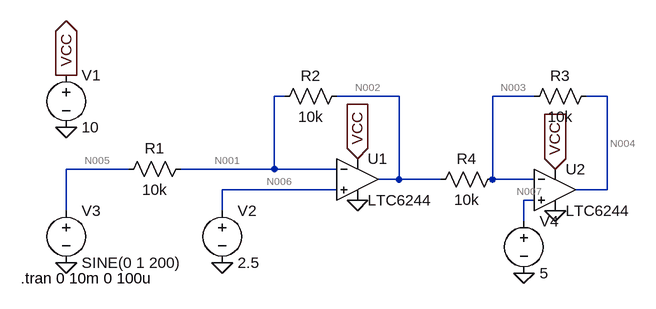
[diagram p0: schematic Draft1.asc]
Draft1.asc, the LTspice schematic file:
Version 4
SHEET 1 880 680
WIRE 256 48 240 48
WIRE 432 48 336 48
WIRE 640 48 576 48
WIRE 752 48 720 48
WIRE 16 160 -80 160
WIRE 240 160 240 48
WIRE 240 160 96 160
WIRE 336 160 240 160
WIRE 432 176 432 48
WIRE 432 176 400 176
WIRE 496 176 432 176
WIRE 576 176 576 48
WIRE 640 176 576 176
WIRE 336 192 160 192
WIRE 752 192 752 48
WIRE 752 192 704 192
WIRE 640 208 624 208
WIRE -80 224 -80 160
WIRE 160 224 160 192
WIRE 624 240 624 208
FLAG 368 208 0
FLAG -80 96 0
FLAG -80 304 0
FLAG 160 304 0
FLAG -80 16 VCC
IOPIN -80 16 Out
FLAG 368 144 VCC
IOPIN 368 144 In
FLAG 672 224 0
FLAG 672 160 VCC
IOPIN 672 160 In
FLAG 624 320 0
SYMBOL Opamps\\LTC6244 368 176 R0
SYMATTR InstName U1
SYMBOL voltage -80 0 R0
WINDOW 123 0 0 Left 0
WINDOW 39 0 0 Left 0
SYMATTR InstName V1
SYMATTR Value 10
SYMBOL voltage 160 208 R0
WINDOW 123 0 0 Left 0
WINDOW 39 0 0 Left 0
SYMATTR InstName V2
SYMATTR Value 2.5
SYMBOL voltage -80 208 R0
WINDOW 123 0 0 Left 0
WINDOW 39 0 0 Left 0
SYMATTR InstName V3
SYMATTR Value SINE(0 1 200)
SYMBOL res 112 144 R90
WINDOW 0 0 56 VBottom 2
WINDOW 3 32 56 VTop 2
SYMATTR InstName R1
SYMATTR Value 10k
SYMBOL res 352 32 R90
WINDOW 0 0 56 VBottom 2
WINDOW 3 32 56 VTop 2
SYMATTR InstName R2
SYMATTR Value 10k
SYMBOL Opamps\\LTC6244 672 192 R0
SYMATTR InstName U2
SYMBOL res 736 32 R90
WINDOW 0 0 56 VBottom 2
WINDOW 3 32 56 VTop 2
SYMATTR InstName R3
SYMATTR Value 10k
SYMBOL res 592 160 R90
WINDOW 0 0 56 VBottom 2
WINDOW 3 32 56 VTop 2
SYMATTR InstName R4
SYMATTR Value 10k
SYMBOL voltage 624 224 R0
WINDOW 123 0 0 Left 0
WINDOW 39 0 0 Left 0
SYMATTR InstName V4
SYMATTR Value 5
TEXT -150 328 Left 2 !.tran 0 10m 0 100u

The netlist it stands for:
* Draft1.asc
XU1 N006 N001 VCC 0 N002 LTC6244  ; pins In+ In- V+ V- OUT
V1 VCC 0 10
V2 N006 0 2.5
V3 N005 0 SINE(0 1 200)
R1 N001 N005 10k
R2 N002 N001 10k
XU2 N007 N003 VCC 0 N004 LTC6244  ; pins In+ In- V+ V- OUT
R3 N004 N003 10k
R4 N003 N002 10k
V4 N007 0 5
.tran 0 10m 0 100u
.backanno
.end

* Results of the author's LTspice run, read from the files saved beside the schematic
* Operating Point, zero values left out:
*   V(n001) = 2.5 V
*   V(n006) = 2.5 V
*   V(vcc) = 10 V
*   V(n002) = 5 V
*   V(n003) = 5 V
*   V(n007) = 5 V
*   V(n004) = 5 V
*   I(R4) = 2.395 pA
*   I(R3) = 2.395 pA
*   I(R2) = 250 µA
*   I(R1) = 250 µA
*   I(V3) = 250 µA
*   I(V1) = -11.7 mA
*   Ix(u1:3) = 5.914 mA
*   Ix(u1:4) = -5.664 mA
*   Ix(u1:5) = -250 µA
*   Ix(u2:3) = 5.788 mA
*   Ix(u2:4) = -5.788 mA
*   Ix(u2:5) = -2.395 pA
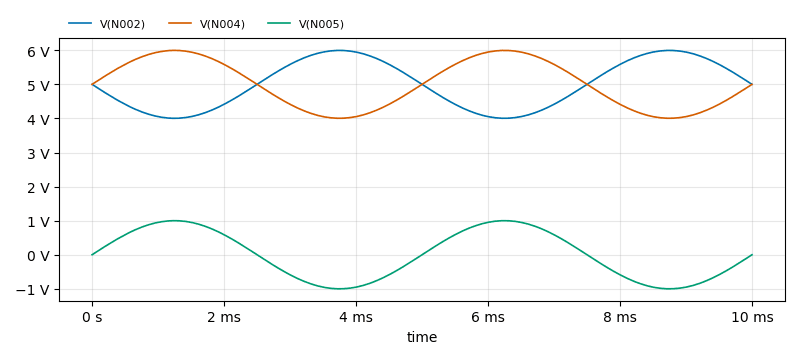
[diagram p1: Transient Analysis of Draft1.asc, plotted from the saved traces]
* Transient Analysis, 1 run:
*   V(N002): min 4.003 V, max 5.995 V, average 5 V, rms 5.049 V, last 5 V
*   V(N004): min 4.005 V, max 5.997 V, average 5 V, rms 5.049 V, last 5 V
*   V(N005): min -999.2 mV, max 999.8 mV, average -52.91 µV, rms 707.2 mV, last 0 V